# EasyEDA Pro project Balanced_Car.epro, board PCB4
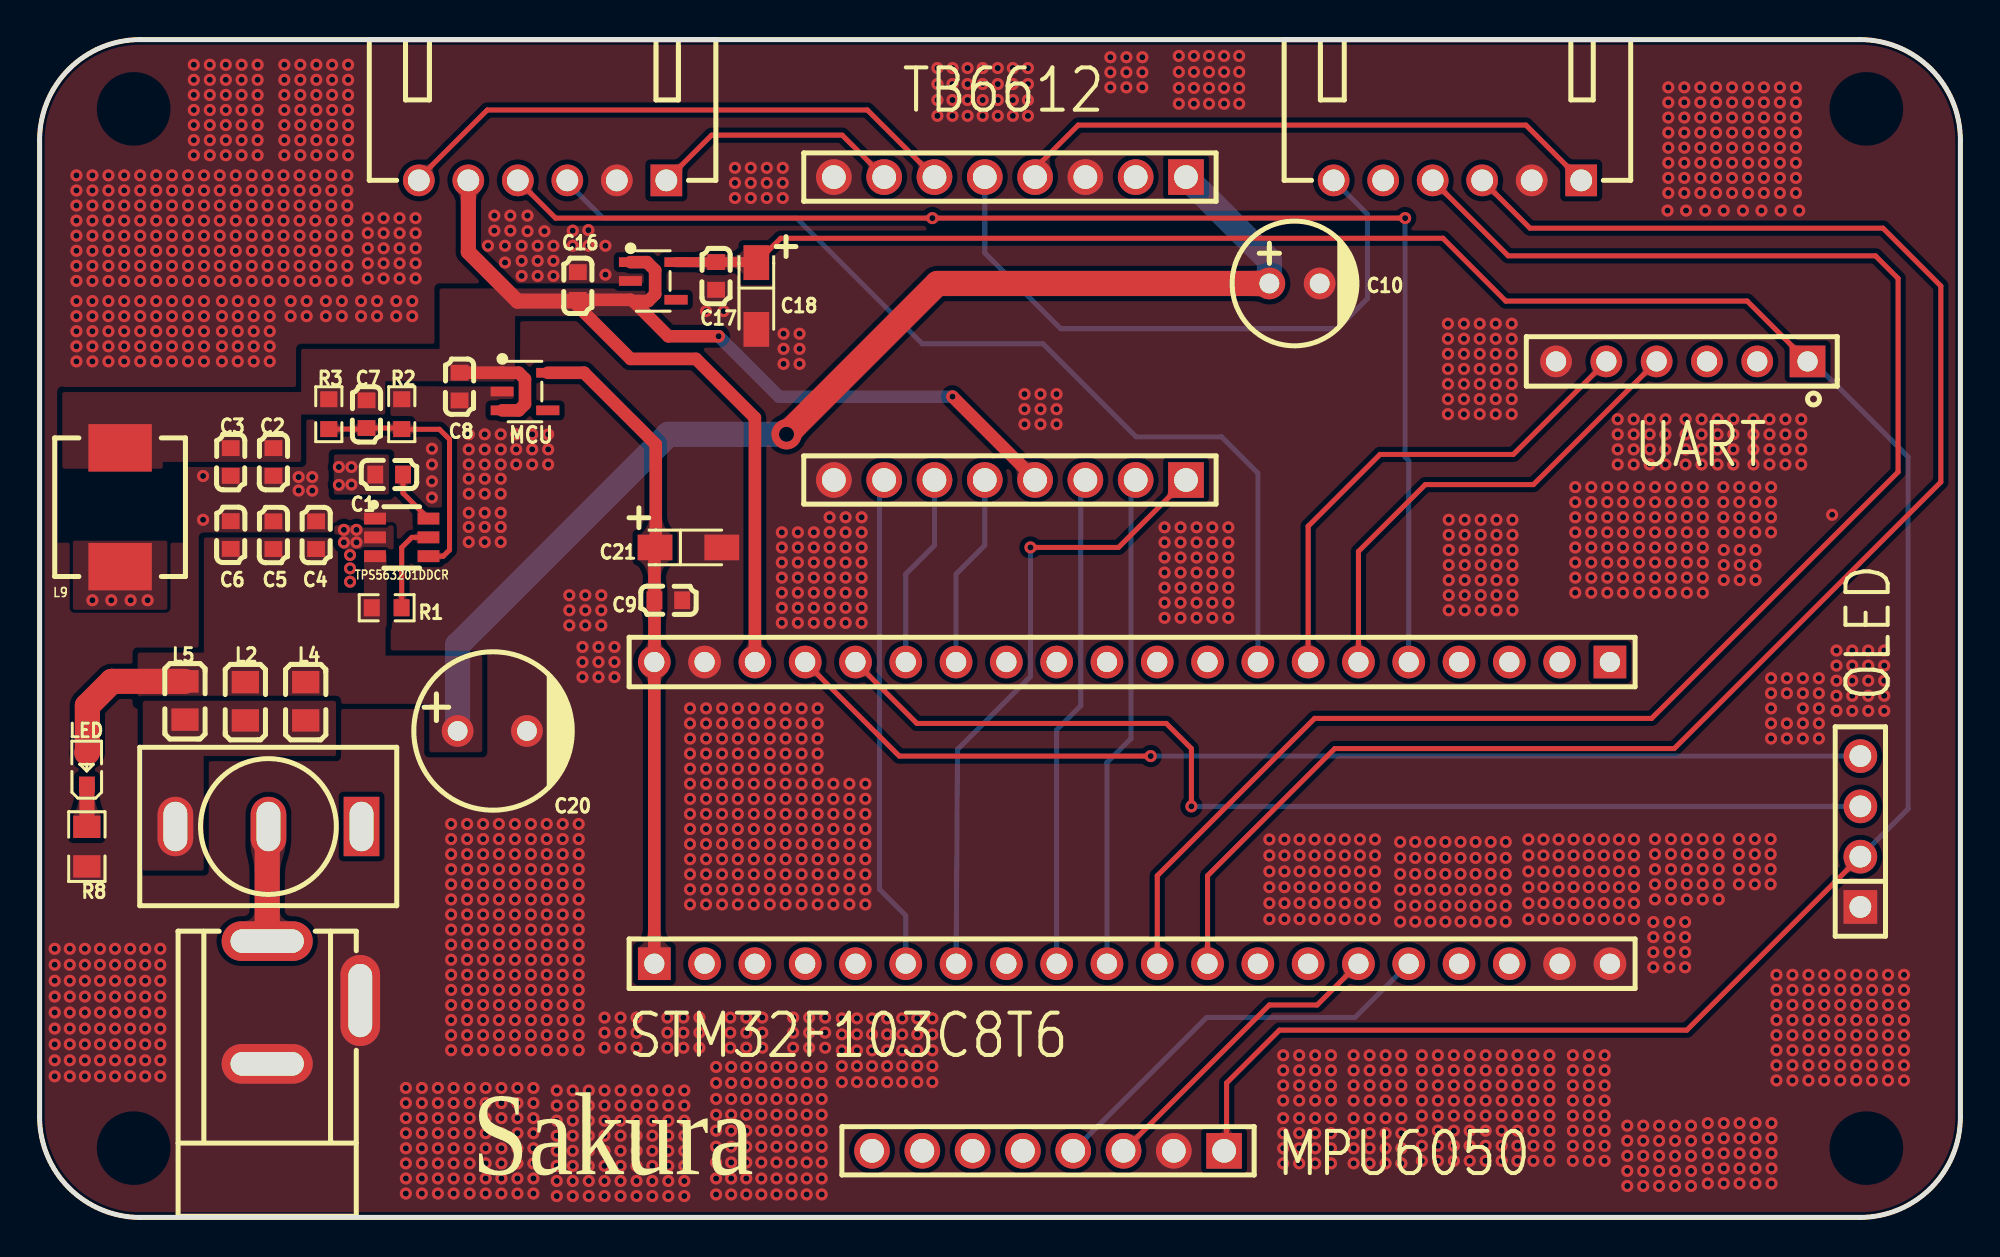
[diagram p1: board, top side]
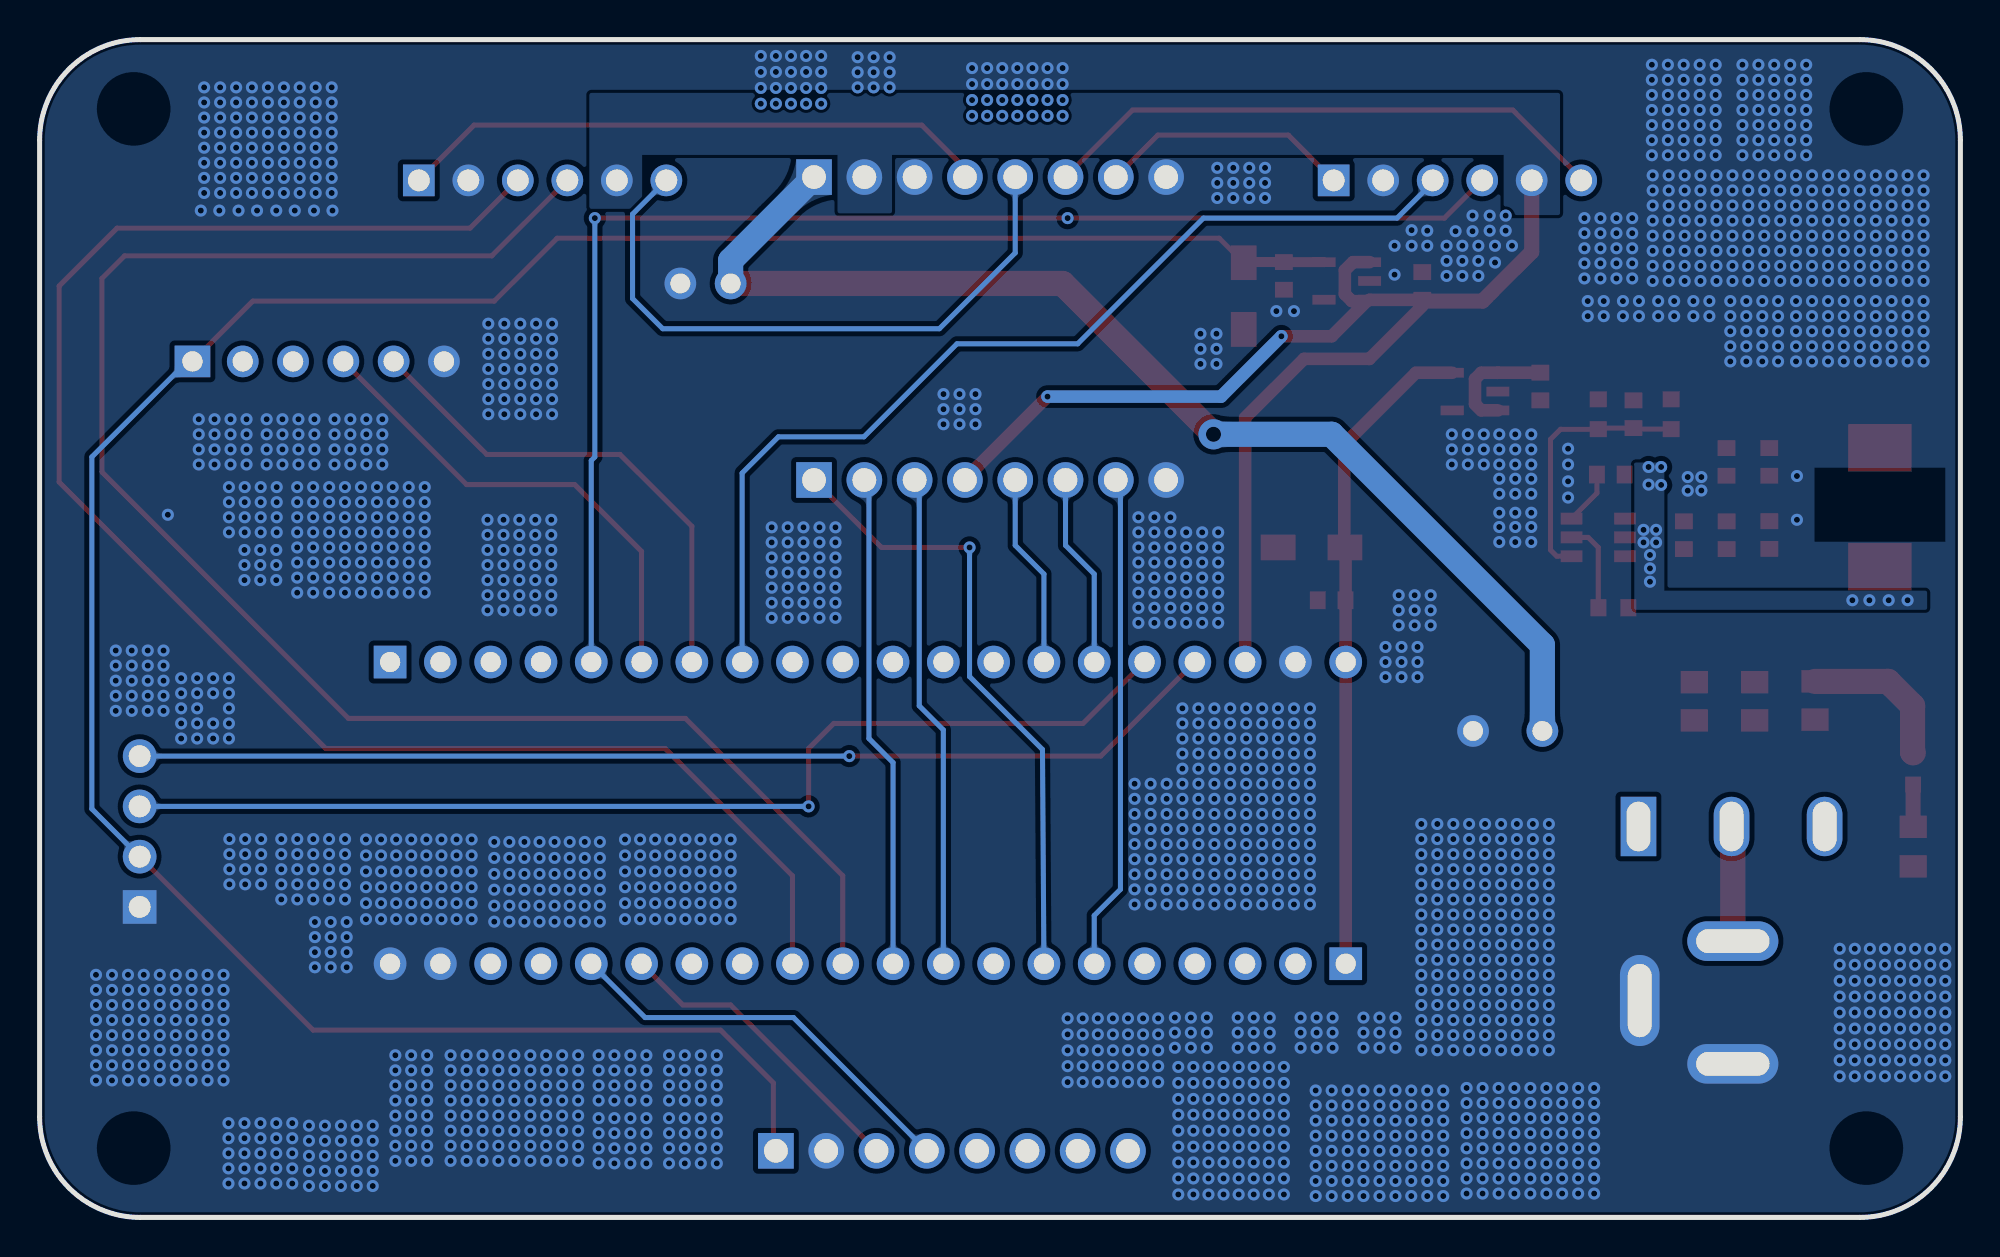
[diagram p2: board, bottom side, seen from below]

Outline 97 x 59.5 mm; copper layers: Top Layer, Bottom Layer. Coordinates in mm from the lower left corner of the outline.
Outline path: 0,54.42 arc(1.49,58.01) 5.08,59.5 91.92,59.5 arc(95.51,58.01) 97,54.42 97,5.08 arc(95.51,1.49) 91.92,0 5.08,0 arc(1.49,1.49) 0,5.08 0,54.42
Stack: Top Layer 0.035mm / Dielectric1 1.51mm FR4 er 4.5 / Bottom Layer 0.035mm

## Design rules (mm)
template: 自定义配置
spacing copperThickness1oz (default): track to track 0.102, other pairs 0.152 to 0.3
spacing copperThickness2oz: track to track 0.203, other pairs 0.152 to 0.3
track width copperThickness1oz (default): min 0.127, default 0.254, max 2.54
track width copperThickness2oz: min 0.203, default 0.254, max 2.54
differential pair differentialPair (default): width min 0.127, default 0.254, max 2.54; gap min 0.152, default 0.152
via viaSize (default): diameter min 0.5, default 0.61, max 10; hole min 0.3, default 0.305, max 6.3

## Placement (name value [footprint] x y rotation side)
C1  100nF  [C0603]  17.65 37.53 0 top
C2  22nF  [C0603]  11.81 38.16 90 top
C3  22nF  [C0603]  9.65 38.16 90 top
C4  10nF  [C0603]  13.96 34.46 270 top
C5  10nF  [C0603]  11.81 34.46 270 top
C6  10nF  [C0603]  9.65 34.47 270 top
C7  100nF  [C0603]  16.51 40.58 90 top
C8  1uF  [C0603]  21.21 41.97 90 top
C9  100nF  [C0603]  31.75 31.18 180 top
C10  220uF  [CAP-TH_BD6.3-P2.50-D1.0-FD]  63.37 47.18 0 top
C16  1uF  [C0603]  27.18 47.05 270 top
C17  100nF  [C0603]  34.16 47.56 90 top
C18  10uF  [CAP-SMD_L3.2-W1.6-RD-C7171]  36.19 46.54 270 top
C20  470uF  [CAP-TH_BD8.0-P3.50-D0.6-FD]  22.86 24.57 0 top
C21  10uF  [CAP-SMD_L3.2-W1.6-RD-C7171]  32.77 33.84 0 top
DC  DC005  [DC-IN-TH_DC005]  13.84 10.86 90 top
H7  -  [HDR-TH_8P-P2.54-V-F-1]  50.93 3.36 180 top
H8  PM254V-11-06-H85  [HDR-TH_6P-P2.54-V-F]  82.93 43.24 180 top
L2  10uH  [L0805]  10.39 26.07 90 top
L4  10uH  [L0805]  13.44 26.07 90 top
L5  10uH  [L0805]  7.34 26.11 90 top
L9  3.3uH  [IND-SMD_L7.0-W6.6]  4.06 35.88 270 top
LED  NCD0603G1  [LED0603-RD]  2.39 22.67 90 top
R1  10K  [R0603]  17.53 30.8 180 top
R2  10K  [R0603]  18.29 40.58 270 top
R3  54.9K  [R0603]  14.61 40.58 90 top
R8  10kΩ  [R0805]  2.39 18.73 270 top
U1  TPS563201DDCR  [SOT-23-6_L2.9-W1.6-P0.95-LS2.8-BR]  18.29 34.35 180 top
U2  -  [HDR-TH_8P-P2.54-V-F-1]  49 37.25 180 top
U3  TPRT9013-33GB  [SOT-23-5_L3.0-W1.7-P0.95-LS2.8-BL]  24.51 41.72 270 top
U5  -  [HDR-TH_8P-P2.54-V-F-1]  49 52.55 180 top
U6  TPRT9013-33GB  [SOT-23-5_L3.0-W1.7-P0.95-LS2.8-BL]  30.99 47.31 270 top
U7  PM2.54-1*4  [HDR-TH_4P-P2.54-V-F]  91.95 19.49 90 top
U11  KH-2.54FH-1X20P-H8.5  [HDR-TH_20P-P2.54-V-F-2]  55.17 12.82 0 top
U12  KH-2.54FH-1X20P-H8.5  [HDR-TH_20P-P2.54-V-F-2]  55.17 28.06 180 top
U13  X8821WR-06S-N0SN  [CONN-TH_6P-P2.50_X8821WR-06S-N2SN]  71.6 52.39 180 top
U14  X8821WR-06S-N0SN  [CONN-TH_6P-P2.50_X8821WR-06S-N2SN]  25.4 52.39 180 top
U16  MT-0-102-A101-M200-RS  [SW-TH_MT-0-103-A101-M200-RS]  11.56 19.75 180 top

## Footprints (pads in the part's own frame, mm; a bottom-side part is the same pattern mirrored in y, then rotated)
C0603
  rect 0.8x0.9 smd: 1(-0.7,0) 2(0.7,0)
CAP-SMD_L3.2-W1.6-RD-C7171
  rect 1.758x1.296 smd: 1(-1.687,0) 2(1.687,0)
CAP-TH_BD6.3-P2.50-D1.0-FD
  round 1.6 hole 1: 1(-1.27,0) 2(1.27,0)
CAP-TH_BD8.0-P3.50-D0.6-FD
  round 1.6 hole 1: 1(-1.75,0) 2(1.75,0)
CONN-TH_6P-P2.50_X8821WR-06S-N2SN
  rect 1.6x1.6 hole 1.1: 1(-6.25,0)
  round 1.6 hole 1.1: 2(-3.75,0) 3(-1.25,0) 4(1.25,0) 5(3.75,0) 6(6.25,0)
DC-IN-TH_DC005
  oval 2x4.6 hole 1.2x3.7: 1(3.1,2.35) 2(-3.1,2.35)
  oval 4.6x2 hole 3.7x1.2: 3(0.1,-2.35)
HDR-TH_4P-P2.54-V-F
  rect 1.7x1.7 hole 1.1: 1(-3.81,0)
  round 1.7 hole 1.1: 2(-1.27,0) 3(1.27,0) 4(3.81,0)
HDR-TH_6P-P2.54-V-F
  rect 1.8x1.6 hole 1.02: 1(-6.35,0)
  round 1.6 hole 1.02: 2(-3.81,0) 3(-1.27,0) 4(1.27,0) 5(3.81,0) 6(6.35,0)
HDR-TH_8P-P2.54-V-F-1
  rect 1.8x1.8 hole 1.2: 1(-8.89,0)
  round 1.8 hole 1.2: 2(-6.35,0) 3(-3.81,0) 4(-1.27,0) 5(1.27,0) 6(3.81,0) 7(6.35,0) 8(8.89,0)
HDR-TH_20P-P2.54-V-F-2
  rect 1.65x1.65 hole 1.02: 1(-24.13,0)
  round 1.65 hole 1.02: 2(-21.59,0) 3(-19.05,0) 4(-16.51,0) 5(-13.97,0) 6(-11.43,0) 7(-8.89,0) 8(-6.35,0) 9(-3.81,0) 10(-1.27,0) 11(1.27,0) 12(3.81,0) 13(6.35,0) 14(8.89,0) 15(11.43,0) 16(13.97,0) 17(16.51,0) 18(19.05,0) 19(21.59,0) 20(24.13,0)
IND-SMD_L7.0-W6.6
  rect 2.4x3.2 smd: 1(-3,0) 2(3,0)
L0805
  rect 1.133x1.377 smd: 1(-0.966,0) 2(0.966,0)
LED0603-RD
  rect 0.8x0.8 smd: 1(-0.799,-0.004) 2(0.799,0.004)
R0603
  rect 0.806x0.864 smd: 1(-0.753,0) 2(0.753,0)
R0805
  rect 1.133x1.377 smd: 1(-1,0) 2(1,0)
SOT-23-5_L3.0-W1.7-P0.95-LS2.8-BL
  rect 0.49x1.157 smd: 1(-0.95,-1.153) 2(0,-1.153) 3(0.95,-1.153)
  rect 0.49x1.175 smd: 4(0.95,1.153) 5(-0.95,1.153)
SOT-23-6_L2.9-W1.6-P0.95-LS2.8-BR
  rect 1.1x0.6 smd: 1(1.35,-0.95) 2(1.35,0) 3(1.35,0.95) 4(-1.35,0.95) 5(-1.35,0) 6(-1.35,-0.95)
SW-TH_MT-0-103-A101-M200-RS
  rect 1.8x3 hole 1.2x2.5: 1(-4.7,0)
  oval 1.8x3 hole 1.2x2.5: 2(0,0) 3(4.7,0)

## Nets
As in the schematic.

Pads without a net: H7 5 6 7 8; H8 2 3; U3 4; U6 4; U11 2 3 4 5 8 13 14 17 18; U12 1 2 3 4 9 10 11 12 13; U16 1

## Via types
v1: diameter 0.61, hole 0.305, Top Layer to Bottom Layer, 2055 vias
v2: diameter 1.524, hole 0.762, Top Layer to Bottom Layer, 1 via

## Routing (per net, layer and track width the routed paths; a pad name or vN(x,y) marks a point on that pad's centre or on a via; arc(x,y) is an arc through that point)
GND:
  vias: v1(0.76,13.57) v1(0.76,12.76) v1(0.76,11.95) v1(0.76,11.16) v1(0.76,10.35) v1(0.76,9.54) v1(0.76,8.74) v1(0.76,7.94) v1(0.76,7.13) v1(1.52,13.57) v1(1.52,12.76) v1(1.52,11.95) v1(1.52,11.16) v1(1.52,10.35) v1(1.52,9.54) v1(1.52,8.74) v1(1.52,7.94) v1(1.52,7.13) v1(1.86,52.64) v1(1.86,51.88) v1(1.86,51.12) v1(1.86,50.35) v1(1.86,49.59) v1(1.86,48.83) v1(1.86,48.07) v1(1.86,47.31) v1(1.86,46.29) v1(1.86,45.53) v1(1.86,44.77) v1(1.86,44) v1(1.86,43.24) v1(2.29,13.57) v1(2.29,12.76) v1(2.29,11.95) v1(2.29,11.16) v1(2.29,10.35) v1(2.29,9.54) v1(2.29,8.74) v1(2.29,7.94) v1(2.29,7.13) v1(2.67,52.64) v1(2.67,51.88) v1(2.67,51.12) v1(2.67,50.35) v1(2.67,49.59) v1(2.67,48.83) v1(2.67,48.07) v1(2.67,47.31) v1(2.67,46.29) v1(2.67,45.53) v1(2.67,44.77) v1(2.67,44) v1(2.67,43.24) v1(3.05,13.57) v1(3.05,12.76) v1(3.05,11.95) v1(3.05,11.16) v1(3.05,10.35) v1(3.05,9.54) v1(3.05,8.74) v1(3.05,7.94) v1(3.05,7.13) v1(3.47,52.64) v1(3.47,51.88) v1(3.47,51.12) v1(3.47,50.35) v1(3.47,49.59) v1(3.47,48.83) v1(3.47,48.07) v1(3.47,47.31) v1(3.47,46.29) v1(3.47,45.53) v1(3.47,44.77) v1(3.47,44) v1(3.47,43.24) v1(3.81,13.57) v1(3.81,12.76) v1(3.81,11.95) v1(3.81,11.16) v1(3.81,10.35) v1(3.81,9.54) v1(3.81,8.74) v1(3.81,7.94) v1(3.81,7.13) v1(4.27,52.64) v1(4.27,51.88) v1(4.27,51.12) v1(4.27,50.35) v1(4.27,49.59) v1(4.27,48.83) v1(4.27,48.07) v1(4.27,47.31) v1(4.27,46.29) v1(4.27,45.53) v1(4.27,44.77) v1(4.27,44) v1(4.27,43.24) v1(4.57,13.57) v1(4.57,12.76) v1(4.57,11.95) v1(4.57,11.16) v1(4.57,10.35) v1(4.57,9.54) v1(4.57,8.74) v1(4.57,7.94) v1(4.57,7.13) v1(5.08,52.64) v1(5.08,51.88) v1(5.08,51.12) v1(5.08,50.35) v1(5.08,49.59) v1(5.08,48.83) v1(5.08,48.07) v1(5.08,47.31) v1(5.08,46.29) v1(5.08,45.53) v1(5.08,44.77) v1(5.08,44) v1(5.08,43.24) v1(5.33,13.57) v1(5.33,12.76) v1(5.33,11.95) v1(5.33,11.16) v1(5.33,10.35) v1(5.33,9.54) v1(5.33,8.74) v1(5.33,7.94) v1(5.33,7.13) v1(5.89,52.64) v1(5.89,51.88) v1(5.89,51.12) v1(5.89,50.35) v1(5.89,49.59) v1(5.89,48.83) v1(5.89,48.07) v1(5.89,47.31) v1(5.89,46.29) v1(5.89,45.53) v1(5.89,44.77) v1(5.89,44) v1(5.89,43.24) v1(6.1,13.57) v1(6.1,12.76) v1(6.1,11.95) v1(6.1,11.16) v1(6.1,10.35) v1(6.1,9.54) v1(6.1,8.74) v1(6.1,7.94) v1(6.1,7.13) v1(6.69,52.64) v1(6.69,51.88) v1(6.69,51.12) v1(6.69,50.35) v1(6.69,49.59) v1(6.69,48.83) v1(6.69,48.07) v1(6.69,47.31) v1(6.69,46.29) v1(6.69,45.53) v1(6.69,44.77) v1(6.69,44) v1(6.69,43.24) v1(7.49,52.64) v1(7.49,51.88) v1(7.49,51.12) v1(7.49,50.35) v1(7.49,49.59) v1(7.49,48.83) v1(7.49,48.07) v1(7.49,47.31) v1(7.49,46.29) v1(7.49,45.53) v1(7.49,44.77) v1(7.49,44) v1(7.49,43.24) v1(7.79,58.23) v1(7.79,57.47) v1(7.79,56.7) v1(7.79,55.94) v1(7.79,55.18) v1(7.79,54.42) v1(7.79,53.66) v1(8.3,52.64) v1(8.3,51.88) v1(8.3,51.12) v1(8.3,50.35) v1(8.3,49.59) v1(8.3,48.83) v1(8.3,48.07) v1(8.3,47.31) v1(8.3,46.29) v1(8.3,45.53) v1(8.3,44.77) v1(8.3,44) v1(8.3,43.24) v1(8.25,37.45) v1(8.25,35.24) v1(8.6,58.23) v1(8.6,57.47) v1(8.6,56.7) v1(8.6,55.94) v1(8.6,55.18) v1(8.6,54.42) v1(8.6,53.66) v1(9.1,52.64) v1(9.1,51.88) v1(9.1,51.12) v1(9.1,50.35) v1(9.1,49.59) v1(9.1,48.83) v1(9.1,48.07) v1(9.1,47.31) v1(9.21,46.29) v1(9.21,45.53) v1(9.21,44.77) v1(9.21,44) v1(9.21,43.24) v1(9.4,58.23) v1(9.4,57.47) v1(9.4,56.7) v1(9.4,55.94) v1(9.4,55.18) v1(9.4,54.42) v1(9.4,53.66) v1(9.91,52.64) v1(9.91,51.88) v1(9.91,51.12) v1(9.91,50.35) v1(9.91,49.59) v1(9.91,48.83) v1(9.91,48.07) v1(9.91,47.31) v1(10,46.29) v1(10,45.53) v1(10,44.77) v1(10,44) v1(10,43.24) v1(10.2,58.23) v1(10.2,57.47) v1(10.2,56.7) v1(10.2,55.94) v1(10.2,55.18) v1(10.2,54.42) v1(10.2,53.66) v1(10.71,52.64) v1(10.71,51.88) v1(10.71,51.12) v1(10.71,50.35) v1(10.71,49.59) v1(10.71,48.83) v1(10.71,48.07) v1(10.71,47.31) v1(10.81,46.29) v1(10.81,45.53) v1(10.81,44.77) v1(10.81,44) v1(10.81,43.24) v1(11.01,58.23) v1(11.01,57.47) v1(11.01,56.7) v1(11.01,55.94) v1(11.01,55.18) v1(11.01,54.42) v1(11.01,53.66) v1(11.51,52.64) v1(11.51,51.88) v1(11.51,51.12) v1(11.51,50.35) v1(11.51,49.59) v1(11.51,48.83) v1(11.51,48.07) v1(11.51,47.31) v1(11.62,46.29) v1(11.62,45.53) v1(11.62,44.77) v1(11.62,44) v1(11.62,43.24) v1(12.32,52.64) v1(12.32,51.88) v1(12.32,51.12) v1(12.32,50.35) v1(12.32,49.59) v1(12.32,48.83) v1(12.32,48.07) v1(12.32,47.31) v1(12.36,58.23) v1(12.36,57.47) v1(12.36,56.7) v1(12.36,55.94) v1(12.36,55.18) v1(12.36,54.42) v1(12.36,53.66) v1(12.68,46.29) v1(12.68,45.53) v1(13.13,52.64) v1(13.13,51.88) v1(13.13,51.12) v1(13.13,50.35) v1(13.13,49.59) v1(13.13,48.83) v1(13.13,48.07) v1(13.13,47.31) v1(13.08,37.4) v1(13.08,36.72) v1(13.17,58.23) v1(13.17,57.47) v1(13.17,56.7) v1(13.17,55.94) v1(13.17,55.18) v1(13.17,54.42) v1(13.17,53.66) v1(13.48,46.29) v1(13.48,45.53) v1(13.77,37.4) v1(13.77,36.71) v1(13.92,52.64) v1(13.92,51.88) v1(13.92,51.12) v1(13.92,50.35) v1(13.92,49.59) v1(13.92,48.83) v1(13.92,48.07) v1(13.92,47.31) v1(13.97,58.23) v1(13.97,57.47) v1(13.97,56.7) v1(13.97,55.94) v1(13.97,55.18) v1(13.97,54.42) v1(13.97,53.66) v1(14.45,46.29) v1(14.45,45.53) v1(14.73,52.64) v1(14.73,51.88) v1(14.73,51.12) v1(14.73,50.35) v1(14.73,49.59) v1(14.73,48.83) v1(14.73,48.07) v1(14.73,47.31) v1(14.77,58.23) v1(14.77,57.47) v1(14.77,56.7) v1(14.77,55.94) v1(14.77,55.18) v1(14.77,54.42) v1(14.77,53.66) v1(15.26,46.29) v1(15.26,45.53) v1(15.54,52.64) v1(15.54,51.88) v1(15.54,51.12) v1(15.54,50.35) v1(15.54,49.59) v1(15.54,48.83) v1(15.54,48.07) v1(15.54,47.31) v1(15.58,58.23) v1(15.58,57.47) v1(15.58,56.7) v1(15.58,55.94) v1(15.58,55.18) v1(15.58,54.42) v1(15.58,53.66) v1(16.23,46.29) v1(16.23,45.53) v1(16.57,50.48) v1(16.57,49.72) v1(16.57,48.96) v1(16.57,48.2) v1(16.57,47.43) v1(17.04,46.29) v1(17.04,45.53) v1(17.37,50.48) v1(17.37,49.72) v1(17.37,48.96) v1(17.37,48.2) v1(17.37,47.43) v1(18.01,46.29) v1(18.01,45.53) v1(18.18,50.48) v1(18.18,49.72) v1(18.18,48.96) v1(18.18,48.2) v1(18.18,47.43) v1(18.5,6.54) v1(18.5,5.78) v1(18.5,5.02) v1(18.5,4.25) v1(18.5,3.49) v1(18.5,2.73) v1(18.5,1.97) v1(18.5,1.21) v1(18.82,46.29) v1(18.82,45.53) v1(18.99,50.48) v1(18.99,49.72) v1(18.99,48.96) v1(18.99,48.2) v1(18.99,47.43) v1(19.3,6.54) v1(19.3,5.78) v1(19.3,5.02) v1(19.3,4.25) v1(19.3,3.49) v1(19.3,2.73) v1(19.3,1.97) v1(19.3,1.21) v1(19.81,38.83) v1(19.81,38.04) v1(19.81,37.18) v1(19.81,36.37) v1(20.11,6.54) v1(20.11,5.78) v1(20.11,5.02) v1(20.11,4.25) v1(20.11,3.49) v1(20.11,2.73) v1(20.11,1.97) v1(20.11,1.21) v1(20.78,19.87) v1(20.78,19.11) v1(20.78,18.35) v1(20.78,17.59) v1(20.78,16.83) v1(20.78,16.06) v1(20.78,15.3) v1(20.78,14.54) v1(20.78,13.78) v1(20.78,13.02) v1(20.78,12.25) v1(20.78,11.49) v1(20.78,10.73) v1(20.78,9.97) v1(20.78,9.21) v1(20.78,8.44) v1(20.91,6.54) v1(20.91,5.78) v1(20.91,5.02) v1(20.91,4.25) v1(20.91,3.49) v1(20.91,2.73) v1(20.91,1.97) v1(20.91,1.21) v1(21.59,19.87) v1(21.59,19.11) v1(21.59,18.35) v1(21.59,17.59) v1(21.59,16.83) v1(21.59,16.06) v1(21.59,15.3) v1(21.59,14.54) v1(21.59,13.78) v1(21.59,13.02) v1(21.59,12.25) v1(21.59,11.49) v1(21.59,10.73) v1(21.59,9.97) v1(21.59,9.21) v1(21.59,8.44) v1(21.67,39.56) v1(21.67,38.8) v1(21.67,38.04) v1(21.67,37.32) v1(21.67,36.55) v1(21.67,35.6) v1(21.67,34.88) v1(21.67,34.11) v1(21.72,6.54) v1(21.72,5.78) v1(21.72,5.02) v1(21.72,4.25) v1(21.72,3.49) v1(21.72,2.73) v1(21.72,1.97) v1(21.72,1.21) v1(22.4,19.87) v1(22.4,19.11) v1(22.4,18.35) v1(22.4,17.59) v1(22.4,16.83) v1(22.4,16.06) v1(22.4,15.3) v1(22.4,14.54) v1(22.4,13.78) v1(22.4,13.02) v1(22.4,12.25) v1(22.4,11.49) v1(22.4,10.73) v1(22.4,9.97) v1(22.4,9.21) v1(22.4,8.44) v1(22.48,39.56) v1(22.48,38.8) v1(22.48,38.04) v1(22.48,37.32) v1(22.48,36.55) v1(22.48,35.6) v1(22.48,34.88) v1(22.48,34.11) v1(22.53,6.54) v1(22.53,5.78) v1(22.53,5.02) v1(22.53,4.25) v1(22.53,3.49) v1(22.53,2.73) v1(22.53,1.97) v1(22.53,1.21) v1(22.64,49.08) v1(22.96,50.61) v1(22.96,49.85) v1(23.19,19.87) v1(23.19,19.11) v1(23.19,18.35) v1(23.19,17.59) v1(23.19,16.83) v1(23.19,16.06) v1(23.19,15.3) v1(23.19,14.54) v1(23.19,13.78) v1(23.19,13.02) v1(23.19,12.25) v1(23.19,11.49) v1(23.19,10.73) v1(23.19,9.97) v1(23.19,9.21) v1(23.19,8.44) v1(23.29,39.56) v1(23.29,38.8) v1(23.29,38.04) v1(23.29,37.32) v1(23.29,36.55) v1(23.29,35.6) v1(23.29,34.88) v1(23.29,34.11) v1(23.32,6.54) v1(23.32,5.78) v1(23.32,5.02) v1(23.32,4.25) v1(23.32,3.49) v1(23.32,2.73) v1(23.32,1.97) v1(23.32,1.21) v1(23.5,49.08) v1(23.5,48.24) v1(23.77,50.61) v1(23.77,49.85) v1(24,19.87) v1(24,19.11) v1(24,18.35) v1(24,17.59) v1(24,16.83) v1(24,16.06) v1(24,15.3) v1(24,14.54) v1(24,13.78) v1(24,13.02) v1(24,12.25) v1(24,11.49) v1(24,10.73) v1(24,9.97) v1(24,9.21) v1(24,8.44) v1(24.07,39.56) v1(24.07,38.8) v1(24.07,38.04) v1(24.13,6.54) v1(24.13,5.78) v1(24.13,5.02) v1(24.13,4.25) v1(24.13,3.49) v1(24.13,2.73) v1(24.13,1.97) v1(24.13,1.21) v1(24.34,49.08) v1(24.34,48.32) v1(24.34,47.56) v1(24.64,50.61) v1(24.64,49.82) v1(24.81,19.87) v1(24.81,19.11) v1(24.81,18.35) v1(24.81,17.59) v1(24.81,16.83) v1(24.81,16.06) v1(24.81,15.3) v1(24.81,14.54) v1(24.81,13.78) v1(24.81,13.02) v1(24.81,12.25) v1(24.81,11.49) v1(24.81,10.73) v1(24.81,9.97) v1(24.81,9.21) v1(24.81,8.44) v1(24.88,39.56) v1(24.88,38.8) v1(24.88,38.04) v1(24.94,6.54) v1(24.94,5.78) v1(24.94,5.02) v1(24.94,4.25) v1(24.94,3.49) v1(24.94,2.73) v1(24.94,1.97) v1(24.94,1.21) v1(25.15,49.08) v1(25.15,48.32) v1(25.15,47.56) v1(25.5,49.82) v1(25.61,19.87) v1(25.61,19.11) v1(25.61,18.35) v1(25.61,17.59) v1(25.61,16.83) v1(25.61,16.06) v1(25.61,15.3) v1(25.61,14.54) v1(25.61,13.78) v1(25.61,13.02) v1(25.61,12.25) v1(25.61,11.49) v1(25.61,10.73) v1(25.61,9.97) v1(25.61,9.21) v1(25.61,8.44) v1(25.68,39.56) v1(25.68,38.8) v1(25.68,38.04) v1(25.95,49.08) v1(25.95,48.32) v1(25.95,47.56) v1(26.12,6.41) v1(26.12,5.65) v1(26.12,4.89) v1(26.12,4.13) v1(26.12,3.36) v1(26.12,2.6) v1(26.12,1.84) v1(26.12,1.08) v1(26.42,19.87) v1(26.42,19.11) v1(26.42,18.35) v1(26.42,17.59) v1(26.42,16.83) v1(26.42,16.06) v1(26.42,15.3) v1(26.42,14.54) v1(26.42,13.78) v1(26.42,13.02) v1(26.42,12.25) v1(26.42,11.49) v1(26.42,10.73) v1(26.42,9.97) v1(26.42,9.21) v1(26.42,8.44) v1(26.75,31.43) v1(26.75,30.67) v1(26.75,29.91) v1(26.92,49.85) v1(26.92,49.08) v1(26.92,6.41) v1(26.92,5.65) v1(26.92,4.89) v1(26.92,4.13) v1(26.92,3.36) v1(26.92,2.6) v1(26.92,1.84) v1(26.92,1.08) v1(27.22,19.87) v1(27.22,19.11) v1(27.22,18.35) v1(27.22,17.59) v1(27.22,16.83) v1(27.22,16.06) v1(27.22,15.3) v1(27.22,14.54) v1(27.22,13.78) v1(27.22,13.02) v1(27.22,12.25) v1(27.22,11.49) v1(27.22,10.73) v1(27.22,9.97) v1(27.22,9.21) v1(27.22,8.44) v1(27.42,28.82) v1(27.42,28.06) v1(27.42,27.29) v1(27.56,31.43) v1(27.56,30.67) v1(27.56,29.91) v1(27.71,49.87) v1(27.71,49.08) v1(27.73,6.41) v1(27.73,5.65) v1(27.73,4.89) v1(27.73,4.13) v1(27.73,3.36) v1(27.73,2.6) v1(27.73,1.84) v1(27.73,1.08) v1(28.22,28.82) v1(28.22,28.06) v1(28.22,27.29) v1(28.37,31.43) v1(28.37,30.67) v1(28.37,29.91) v1(28.53,10.1) v1(28.53,9.33) v1(28.53,8.57) v1(28.53,6.41) v1(28.53,5.65) v1(28.53,4.89) v1(28.53,4.13) v1(28.53,3.36) v1(28.53,2.6) v1(28.53,1.84) v1(28.53,1.08) v1(28.57,49.08) v1(28.57,47.62) v1(29.03,28.82) v1(29.03,28.06) v1(29.03,27.29) v1(29.34,10.1) v1(29.34,9.33) v1(29.34,8.57) v1(29.34,6.41) v1(29.34,5.65) v1(29.34,4.89) v1(29.34,4.13) v1(29.34,3.36) v1(29.34,2.6) v1(29.34,1.84) v1(29.34,1.08) v1(30.15,10.1) v1(30.15,9.33) v1(30.15,8.57) v1(30.15,6.41) v1(30.15,5.65) v1(30.15,4.89) v1(30.15,4.13) v1(30.15,3.36) v1(30.15,2.6) v1(30.15,1.84) v1(30.15,1.08) v1(30.94,6.41) v1(30.94,5.65) v1(30.94,4.89) v1(30.94,4.13) v1(30.94,3.36) v1(30.94,2.6) v1(30.94,1.84) v1(30.94,1.08) v1(31.7,10.1) v1(31.7,9.33) v1(31.7,8.57) v1(31.75,6.41) v1(31.75,5.65) v1(31.75,4.89) v1(31.75,4.13) v1(31.75,3.36) v1(31.75,2.6) v1(31.75,1.84) v1(31.75,1.08) v1(32.51,10.1) v1(32.51,9.33) v1(32.51,8.57) v1(32.56,6.41) v1(32.56,5.65) v1(32.56,4.89) v1(32.56,4.13) v1(32.56,3.36) v1(32.56,2.6) v1(32.56,1.84) v1(32.56,1.08) v1(32.85,25.72) v1(32.85,24.95) v1(32.85,24.19) v1(32.85,23.43) v1(32.85,22.67) v1(32.85,21.91) v1(32.85,21.14) v1(32.85,20.38) v1(32.85,19.62) v1(32.85,18.86) v1(32.85,18.1) v1(32.85,17.33) v1(32.85,16.57) v1(32.85,15.81) v1(33.32,10.1) v1(33.32,9.33) v1(33.32,8.57) v1(33.66,45.78) v1(33.66,25.72) v1(33.66,24.95) v1(33.66,24.19) v1(33.66,23.43) v1(33.66,22.67) v1(33.66,21.91) v1(33.66,21.14) v1(33.66,20.38) v1(33.66,19.62) v1(33.66,18.86) v1(33.66,18.1) v1(33.66,17.33) v1(33.66,16.57) v1(33.66,15.81) v1(34.16,7.6) v1(34.16,6.79) v1(34.16,5.99) v1(34.16,5.19) v1(34.16,4.38) v1(34.16,3.57) v1(34.16,2.78) v1(34.16,1.97) v1(34.16,1.16) v1(34.54,45.78) v1(34.46,25.72) v1(34.46,24.95) v1(34.46,24.19) v1(34.46,23.43) v1(34.46,22.67) v1(34.46,21.91) v1(34.46,21.14) v1(34.46,20.38) v1(34.46,19.62) v1(34.46,18.86) v1(34.46,18.1) v1(34.46,17.33) v1(34.46,16.57) v1(34.46,15.81) v1(34.88,10.1) v1(34.88,9.33) v1(34.88,8.57) v1(34.93,7.6) v1(34.93,6.79) v1(34.93,5.99) v1(34.93,5.19) v1(34.93,4.38) v1(34.93,3.57) v1(34.93,2.78) v1(34.93,1.97) v1(34.93,1.16) v1(35.12,53.02) v1(35.12,52.26) v1(35.12,51.5) v1(35.26,25.72) v1(35.26,24.95) v1(35.26,24.19) v1(35.26,23.43) v1(35.26,22.67) v1(35.26,21.91) v1(35.26,21.14) v1(35.26,20.38) v1(35.26,19.62) v1(35.26,18.86) v1(35.26,18.1) v1(35.26,17.33) v1(35.26,16.57) v1(35.26,15.81) v1(35.69,10.1) v1(35.69,9.33) v1(35.69,8.57) v1(35.69,7.6) v1(35.69,6.79) v1(35.69,5.99) v1(35.69,5.19) v1(35.69,4.38) v1(35.69,3.57) v1(35.69,2.78) v1(35.69,1.97) v1(35.69,1.16) v1(35.91,53.02) v1(35.91,52.26) v1(35.91,51.5) v1(36.07,25.72) v1(36.07,24.95) v1(36.07,24.19) v1(36.07,23.43) v1(36.07,22.67) v1(36.07,21.91) v1(36.07,21.14) v1(36.07,20.38) v1(36.07,19.62) v1(36.07,18.86) v1(36.07,18.1) v1(36.07,17.33) v1(36.07,16.57) v1(36.07,15.81) v1(36.45,7.6) v1(36.45,6.79) v1(36.45,5.99) v1(36.45,5.19) v1(36.45,4.38) v1(36.45,3.57) v1(36.45,2.78) v1(36.45,1.97) v1(36.45,1.16) v1(36.5,10.1) v1(36.5,9.33) v1(36.5,8.57) v1(36.72,53.02) v1(36.72,52.26) v1(36.72,51.5) v1(36.88,25.72) v1(36.88,24.95) v1(36.88,24.19) v1(36.88,23.43) v1(36.88,22.67) v1(36.88,21.91) v1(36.88,21.14) v1(36.88,20.38) v1(36.88,19.62) v1(36.88,18.86) v1(36.88,18.1) v1(36.88,17.33) v1(36.88,16.57) v1(36.88,15.81) v1(37.21,7.6) v1(37.21,6.79) v1(37.21,5.99) v1(37.21,5.19) v1(37.21,4.38) v1(37.21,3.57) v1(37.21,2.78) v1(37.21,1.97) v1(37.21,1.16) v1(37.53,53.02) v1(37.53,52.26) v1(37.53,51.5) v1(37.48,34.61) v1(37.48,33.84) v1(37.48,33.08) v1(37.48,32.32) v1(37.48,31.56) v1(37.48,30.8) v1(37.48,30.03) v1(37.57,44.64) v1(37.57,43.88) v1(37.57,43.12) v1(37.67,25.72) v1(37.67,24.95) v1(37.67,24.19) v1(37.67,23.43) v1(37.67,22.67) v1(37.67,21.91) v1(37.67,21.14) v1(37.67,20.38) v1(37.67,19.62) v1(37.67,18.86) v1(37.67,18.1) v1(37.67,17.33) v1(37.67,16.57) v1(37.67,15.81) v1(37.97,7.6) v1(37.97,6.79) v1(37.97,5.99) v1(37.97,5.19) v1(37.97,4.38) v1(37.97,3.57) v1(37.97,2.78) v1(37.97,1.97) v1(37.97,1.16) v1(38.05,10.1) v1(38.05,9.33) v1(38.05,8.57) v1(38.29,34.61) v1(38.29,33.84) v1(38.29,33.08) v1(38.29,32.32) v1(38.29,31.56) v1(38.29,30.8) v1(38.29,30.03) v1(38.38,44.64) v1(38.38,43.88) v1(38.38,43.12) v1(38.48,25.72) v1(38.48,24.95) v1(38.48,24.19) v1(38.48,23.43) v1(38.48,22.67) v1(38.48,21.91) v1(38.48,21.14) v1(38.48,20.38) v1(38.48,19.62) v1(38.48,18.86) v1(38.48,18.1) v1(38.48,17.33) v1(38.48,16.57) v1(38.48,15.81) v1(38.74,7.6) v1(38.74,6.79) v1(38.74,5.99) v1(38.74,5.19) v1(38.74,4.38) v1(38.74,3.57) v1(38.74,2.78) v1(38.74,1.97) v1(38.74,1.16) v1(38.86,10.1) v1(38.86,9.33) v1(38.86,8.57) v1(39.1,34.61) v1(39.1,33.84) v1(39.1,33.08) v1(39.1,32.32) v1(39.1,31.56) v1(39.1,30.8) v1(39.1,30.03) v1(39.29,25.72) v1(39.29,24.95) v1(39.29,24.19) v1(39.29,23.43) v1(39.29,22.67) v1(39.29,21.91) v1(39.29,21.14) v1(39.29,20.38) v1(39.29,19.62) v1(39.29,18.86) v1(39.29,18.1) v1(39.29,17.33) v1(39.29,16.57) v1(39.29,15.81) v1(39.5,7.6) v1(39.5,6.79) v1(39.5,5.99) v1(39.5,5.19) v1(39.5,4.38) v1(39.5,3.57) v1(39.5,2.78) v1(39.5,1.97) v1(39.5,1.16) v1(39.67,10.1) v1(39.67,9.33) v1(39.67,8.57) v1(39.9,35.37) v1(39.9,34.61) v1(39.9,33.84) v1(39.9,33.08) v1(39.9,32.32) v1(39.9,31.56) v1(39.9,30.8) v1(39.9,30.03) v1(40.09,21.91) v1(40.09,21.14) v1(40.09,20.38) v1(40.09,19.62) v1(40.09,18.86) v1(40.09,18.1) v1(40.09,17.33) v1(40.09,16.57) v1(40.09,15.81) v1(40.51,10.05) v1(40.51,9.25) v1(40.51,8.44) v1(40.51,7.64) v1(40.51,6.83) v1(40.7,35.37) v1(40.7,34.61) v1(40.7,33.84) v1(40.7,33.08) v1(40.7,32.32) v1(40.7,31.56) v1(40.7,30.8) v1(40.7,30.03) v1(40.89,21.91) v1(40.89,21.14) v1(40.89,20.38) v1(40.89,19.62) v1(40.89,18.86) v1(40.89,18.1) v1(40.89,17.33) v1(40.89,16.57) v1(40.89,15.81) v1(41.28,10.05) v1(41.28,9.25) v1(41.28,8.44) v1(41.28,7.64) v1(41.28,6.83) v1(41.51,35.37) v1(41.51,34.61) v1(41.51,33.84) v1(41.51,33.08) v1(41.51,32.32) v1(41.51,31.56) v1(41.51,30.8) v1(41.51,30.03) v1(41.7,21.91) v1(41.7,21.14) v1(41.7,20.38) v1(41.7,19.62) v1(41.7,18.86) v1(41.7,18.1) v1(41.7,17.33) v1(41.7,16.57) v1(41.7,15.81) v1(42.04,10.05) v1(42.04,9.25) v1(42.04,8.44) v1(42.04,7.64) v1(42.04,6.83) v1(42.8,10.05) v1(42.8,9.25) v1(42.8,8.44) v1(42.8,7.64) v1(42.8,6.83) v1(43.56,10.05) v1(43.56,9.25) v1(43.56,8.44) v1(43.56,7.64) v1(43.56,6.83) v1(44.32,10.05) v1(44.32,9.25) v1(44.32,8.44) v1(44.32,7.64) v1(44.32,6.83) v1(45.09,10.05) v1(45.09,9.25) v1(45.09,8.44) v1(45.09,7.64) v1(45.09,6.83) v1(45.34,58.06) v1(45.34,57.25) v1(45.34,56.45) v1(45.34,55.65) v1(46.1,58.06) v1(46.1,57.25) v1(46.1,56.45) v1(46.1,55.65) v1(46.86,58.06) v1(46.86,57.25) v1(46.86,56.45) v1(46.86,55.65) v1(47.62,58.06) v1(47.62,57.25) v1(47.62,56.45) v1(47.62,55.65) v1(48.39,58.06) v1(48.39,57.25) v1(48.39,56.45) v1(48.39,55.65) v1(49.15,58.06) v1(49.15,57.25) v1(49.15,56.45) v1(49.15,55.65) v1(49.74,41.59) v1(49.74,40.83) v1(49.74,40.07) v1(49.91,58.06) v1(49.91,57.25) v1(49.91,56.45) v1(49.91,55.65) v1(50.55,41.59) v1(50.55,40.83) v1(50.55,40.07) v1(51.35,41.59) v1(51.35,40.83) v1(51.35,40.07) v1(54.07,58.61) v1(54.07,57.85) v1(54.07,57.09) v1(54.88,58.61) v1(54.88,57.85) v1(54.88,57.09) v1(55.69,58.61) v1(55.69,57.85) v1(55.69,57.09) v1(56.81,34.86) v1(56.81,34.1) v1(56.81,33.34) v1(56.81,32.57) v1(56.81,31.81) v1(56.81,31.05) v1(56.81,30.29) v1(57.53,58.67) v1(57.53,57.86) v1(57.53,57.06) v1(57.53,56.26) v1(57.62,34.86) v1(57.62,34.1) v1(57.62,33.34) v1(57.62,32.57) v1(57.62,31.81) v1(57.62,31.05) v1(57.62,30.29) v1(58.29,58.67) v1(58.29,57.86) v1(58.29,57.06) v1(58.29,56.26) v1(58.43,34.86) v1(58.43,34.1) v1(58.43,33.34) v1(58.43,32.57) v1(58.43,31.81) v1(58.43,31.05) v1(58.43,30.29) v1(59.06,58.67) v1(59.06,57.86) v1(59.06,57.06) v1(59.06,56.26) v1(59.22,34.86) v1(59.22,34.1) v1(59.22,33.34) v1(59.22,32.57) v1(59.22,31.81) v1(59.22,31.05) v1(59.22,30.29) v1(59.82,58.67) v1(59.82,57.86) v1(59.82,57.06) v1(59.82,56.26) v1(60.03,34.86) v1(60.03,34.1) v1(60.03,33.34) v1(60.03,32.57) v1(60.03,31.81) v1(60.03,31.05) v1(60.03,30.29) v1(60.58,58.67) v1(60.58,57.86) v1(60.58,57.06) v1(60.58,56.26) v1(62.1,19.09) v1(62.1,18.29) v1(62.1,17.48) v1(62.1,16.68) v1(62.1,15.87) v1(62.1,15.07) v1(62.8,8.19) v1(62.8,7.43) v1(62.8,6.67) v1(62.8,5.9) v1(62.8,5.02) v1(62.8,4.25) v1(62.8,3.49) v1(62.8,2.73) v1(62.87,19.09) v1(62.87,18.29) v1(62.87,17.48) v1(62.87,16.68) v1(62.87,15.87) v1(62.87,15.07) v1(63.63,19.09) v1(63.63,18.29) v1(63.63,17.48) v1(63.63,16.68) v1(63.63,15.87) v1(63.63,15.07) v1(63.61,8.19) v1(63.61,7.43) v1(63.61,6.67) v1(63.61,5.9) v1(63.61,5.02) v1(63.61,4.25) v1(63.61,3.49) v1(63.61,2.73) v1(64.39,19.09) v1(64.39,18.29) v1(64.39,17.48) v1(64.39,16.68) v1(64.39,15.87) v1(64.39,15.07) v1(64.42,8.19) v1(64.42,7.43) v1(64.42,6.67) v1(64.42,5.9) v1(64.42,5.02) v1(64.42,4.25) v1(64.42,3.49) v1(64.42,2.73) v1(65.15,19.09) v1(65.15,18.29) v1(65.15,17.48) v1(65.15,16.68) v1(65.15,15.87) v1(65.15,15.07) v1(65.21,8.19) v1(65.21,7.43) v1(65.21,6.67) v1(65.21,5.9) v1(65.21,5.02) v1(65.21,4.25) v1(65.21,3.49) v1(65.21,2.73) v1(65.91,19.09) v1(65.91,18.29) v1(65.91,17.48) v1(65.91,16.68) v1(65.91,15.87) v1(65.91,15.07) v1(66.36,8.19) v1(66.36,7.43) v1(66.36,6.67) v1(66.36,5.9) v1(66.36,5.02) v1(66.36,4.25) v1(66.36,3.49) v1(66.36,2.73) v1(66.68,19.09) v1(66.68,18.29) v1(66.68,17.48) v1(66.68,16.68) v1(66.68,15.87) v1(66.68,15.07) v1(67.17,8.19) v1(67.17,7.43) v1(67.17,6.67) v1(67.17,5.9) v1(67.17,5.02) v1(67.17,4.25) v1(67.17,3.49) v1(67.17,2.73) v1(67.44,19.09) v1(67.44,18.29) v1(67.44,17.48) v1(67.44,16.68) v1(67.44,15.87) v1(67.44,15.07) v1(67.97,8.19) v1(67.97,7.43) v1(67.97,6.67) v1(67.97,5.9) v1(67.97,5.02) v1(67.97,4.25) v1(67.97,3.49) v1(67.97,2.73) v1(68.71,18.97) v1(68.71,18.16) v1(68.71,17.35) v1(68.71,16.55) v1(68.71,15.75) v1(68.71,14.94) v1(68.77,8.19) v1(68.77,7.43) v1(68.77,6.67) v1(68.77,5.9) v1(68.77,5.02) v1(68.77,4.25) v1(68.77,3.49) v1(68.77,2.73) v1(69.47,18.97) v1(69.47,18.16) v1(69.47,17.35) v1(69.47,16.55) v1(69.47,15.75) v1(69.47,14.94) v1(69.8,8.19) v1(69.8,7.43) v1(69.8,6.67) v1(69.8,5.9) v1(69.8,5.14) v1(69.8,4.38) v1(69.8,3.62) v1(69.8,2.86) v1(70.23,18.97) v1(70.23,18.16) v1(70.23,17.35) v1(70.23,16.55) v1(70.23,15.75) v1(70.23,14.94) v1(70.61,8.19) v1(70.61,7.43) v1(70.61,6.67) v1(70.61,5.9) v1(70.61,5.14) v1(70.61,4.38) v1(70.61,3.62) v1(70.61,2.86) v1(70.99,18.97) v1(70.99,18.16) v1(70.99,17.35) v1(70.99,16.55) v1(70.99,15.75) v1(70.99,14.94) v1(71.12,45.15) v1(71.12,44.39) v1(71.12,43.62) v1(71.12,42.86) v1(71.12,42.1) v1(71.12,41.34) v1(71.12,40.58) v1(71.16,35.24) v1(71.16,34.48) v1(71.16,33.72) v1(71.16,32.96) v1(71.16,32.19) v1(71.16,31.43) v1(71.16,30.67) v1(71.42,8.19) v1(71.42,7.43) v1(71.42,6.67) v1(71.42,5.9) v1(71.42,5.14) v1(71.42,4.38) v1(71.42,3.62) v1(71.42,2.86) v1(71.75,18.97) v1(71.75,18.16) v1(71.75,17.35) v1(71.75,16.55) v1(71.75,15.75) v1(71.75,14.94) v1(71.93,45.15) v1(71.93,44.39) v1(71.93,43.62) v1(71.93,42.86) v1(71.93,42.1) v1(71.93,41.34) v1(71.93,40.58) v1(71.97,35.24) v1(71.97,34.48) v1(71.97,33.72) v1(71.97,32.96) v1(71.97,32.19) v1(71.97,31.43) v1(71.97,30.67) v1(72.22,8.19) v1(72.22,7.43) v1(72.22,6.67) v1(72.22,5.9) v1(72.22,5.14) v1(72.22,4.38) v1(72.22,3.62) v1(72.22,2.86) v1(72.52,18.97) v1(72.52,18.16) v1(72.52,17.35) v1(72.52,16.55) v1(72.52,15.75) v1(72.52,14.94) v1(72.72,45.15) v1(72.72,44.39) v1(72.72,43.62) v1(72.72,42.86) v1(72.72,42.1) v1(72.72,41.34) v1(72.72,40.58) v1(72.78,35.24) v1(72.78,34.48) v1(72.78,33.72) v1(72.78,32.96) v1(72.78,32.19) v1(72.78,31.43) v1(72.78,30.67) v1(73.03,8.19) v1(73.03,7.43) v1(73.03,6.67) v1(73.03,5.9) v1(73.03,5.14) v1(73.03,4.38) v1(73.03,3.62) v1(73.03,2.86) v1(73.28,18.97) v1(73.28,18.16) v1(73.28,17.35) v1(73.28,16.55) v1(73.28,15.75) v1(73.28,14.94) v1(73.53,45.15) v1(73.53,44.39) v1(73.53,43.62) v1(73.53,42.86) v1(73.53,42.1) v1(73.53,41.34) v1(73.53,40.58) v1(73.57,35.24) v1(73.57,34.48) v1(73.57,33.72) v1(73.57,32.96) v1(73.57,32.19) v1(73.57,31.43) v1(73.57,30.67) v1(73.83,8.19) v1(73.83,7.43) v1(73.83,6.67) v1(73.83,5.9) v1(73.83,5.14) v1(73.83,4.38) v1(73.83,3.62) v1(73.83,2.86) v1(74.04,18.97) v1(74.04,18.16) v1(74.04,17.35) v1(74.04,16.55) v1(74.04,15.75) v1(74.04,14.94) v1(74.34,45.15) v1(74.34,44.39) v1(74.34,43.62) v1(74.34,42.86) v1(74.34,42.1) v1(74.34,41.34) v1(74.34,40.58) v1(74.38,35.24) v1(74.38,34.48) v1(74.38,33.72) v1(74.38,32.96) v1(74.38,32.19) v1(74.38,31.43) v1(74.38,30.67) v1(74.63,8.19) v1(74.63,7.43) v1(74.63,6.67) v1(74.63,5.9) v1(74.63,5.14) v1(74.63,4.38) v1(74.63,3.62) v1(74.63,2.86) v1(75.18,19.09) v1(75.18,18.29) v1(75.18,17.48) v1(75.18,16.68) v1(75.18,15.87) v1(75.18,15.07) v1(75.44,8.19) v1(75.44,7.43) v1(75.44,6.67) v1(75.44,5.9) v1(75.44,5.14) v1(75.44,4.38) v1(75.44,3.62) v1(75.44,2.86) v1(75.95,19.09) v1(75.95,18.29) v1(75.95,17.48) v1(75.95,16.68) v1(75.95,15.87) v1(75.95,15.07) v1(76.25,8.19) v1(76.25,7.43) v1(76.25,6.67) v1(76.25,5.9) v1(76.25,5.14) v1(76.25,4.38) v1(76.25,3.62) v1(76.25,2.86) v1(76.71,19.09) v1(76.71,18.29) v1(76.71,17.48) v1(76.71,16.68) v1(76.71,15.87) v1(76.71,15.07) v1(77.43,8.19) v1(77.43,7.43) v1(77.43,6.67) v1(77.43,5.9) v1(77.43,5.14) v1(77.43,4.38) v1(77.43,3.62) v1(77.43,2.86) v1(77.47,19.09) v1(77.47,18.29) v1(77.47,17.48) v1(77.47,16.68) v1(77.47,15.87) v1(77.47,15.07) v1(77.55,36.89) v1(77.55,36.13) v1(77.55,35.37) v1(77.55,34.61) v1(77.55,33.84) v1(77.55,33.08) v1(77.55,32.32) v1(77.55,31.56) v1(78.23,19.09) v1(78.23,18.29) v1(78.23,17.48) v1(78.23,16.68) v1(78.23,15.87) v1(78.23,15.07) v1(78.24,8.19) v1(78.24,7.43) v1(78.24,6.67) v1(78.24,5.9) v1(78.24,5.14) v1(78.24,4.38) v1(78.24,3.62) v1(78.24,2.86) v1(78.36,36.89) v1(78.36,36.13) v1(78.36,35.37) v1(78.36,34.61) v1(78.36,33.84) v1(78.36,33.08) v1(78.36,32.32) v1(78.36,31.56) v1(78.99,19.09) v1(78.99,18.29) v1(78.99,17.48) v1(78.99,16.68) v1(78.99,15.87) v1(78.99,15.07) v1(79.03,8.19) v1(79.03,7.43) v1(79.03,6.67) v1(79.03,5.9) v1(79.03,5.14) v1(79.03,4.38) v1(79.03,3.62) v1(79.03,2.86) v1(79.17,36.89) v1(79.17,36.13) v1(79.17,35.37) v1(79.17,34.61) v1(79.17,33.84) v1(79.17,33.08) v1(79.17,32.32) v1(79.17,31.56) v1(79.69,40.32) v1(79.69,39.56) v1(79.69,38.8) v1(79.69,38.04) v1(79.76,19.09) v1(79.76,18.29) v1(79.76,17.48) v1(79.76,16.68) v1(79.76,15.87) v1(79.76,15.07) v1(79.96,36.89) v1(79.96,36.13) v1(79.96,35.37) v1(79.96,34.61) v1(79.96,33.84) v1(79.96,33.08) v1(79.96,32.32) v1(79.96,31.56) v1(80.18,4.63) v1(80.18,3.87) v1(80.18,3.11) v1(80.18,2.35) v1(80.18,1.59) v1(80.5,40.32) v1(80.5,39.56) v1(80.5,38.8) v1(80.5,38.04) v1(80.52,19.09) v1(80.52,18.29) v1(80.52,17.48) v1(80.52,16.68) v1(80.52,15.87) v1(80.52,15.07) v1(80.77,36.89) v1(80.77,36.13) v1(80.77,35.37) v1(80.77,34.61) v1(80.77,33.84) v1(80.77,33.08) v1(80.77,32.32) v1(80.77,31.56) v1(80.99,4.63) v1(80.99,3.87) v1(80.99,3.11) v1(80.99,2.35) v1(80.99,1.59) v1(81.31,40.32) v1(81.31,39.56) v1(81.31,38.8) v1(81.31,38.04) v1(81.49,14.92) v1(81.49,14.16) v1(81.49,13.4) v1(81.49,12.64) v1(81.58,36.89) v1(81.58,36.13) v1(81.58,35.37) v1(81.58,34.61) v1(81.58,33.84) v1(81.58,33.08) v1(81.58,32.32) v1(81.58,31.56) v1(81.57,19.11) v1(81.57,18.35) v1(81.57,17.59) v1(81.57,16.83) v1(81.57,16.06) v1(81.78,4.63) v1(81.78,3.87) v1(81.78,3.11) v1(81.78,2.35) v1(81.78,1.59) v1(82.11,40.32) v1(82.11,39.56) v1(82.11,38.8) v1(82.11,38.04) v1(82.25,57.09) v1(82.25,56.32) v1(82.25,55.56) v1(82.25,54.8) v1(82.25,54.04) v1(82.25,53.28) v1(82.25,52.51) v1(82.25,51.75) v1(82.21,50.86) v1(82.3,14.92) v1(82.3,14.16) v1(82.3,13.4) v1(82.3,12.64) v1(82.38,36.89) v1(82.38,36.13) v1(82.38,35.37) v1(82.38,34.61) v1(82.38,33.84) v1(82.38,33.08) v1(82.38,32.32) v1(82.38,31.56) v1(82.38,19.11) v1(82.38,18.35) v1(82.38,17.59) v1(82.38,16.83) v1(82.38,16.06) v1(82.59,4.63) v1(82.59,3.87) v1(82.59,3.11) v1(82.59,2.35) v1(82.59,1.59) v1(83.06,57.09) v1(83.06,56.32) v1(83.06,55.56) v1(83.06,54.8) v1(83.06,54.04) v1(83.06,53.28) v1(83.06,52.51) v1(83.06,51.75) v1(83.14,50.86) v1(83.12,40.32) v1(83.12,39.56) v1(83.12,38.8) v1(83.12,38.04) v1(83.1,14.92) v1(83.1,14.16) v1(83.1,13.4) v1(83.1,12.64) v1(83.19,36.89) v1(83.19,36.13) v1(83.19,35.37) v1(83.19,34.61) v1(83.19,33.84) v1(83.19,33.08) v1(83.19,32.32) v1(83.19,31.56) v1(83.18,19.11) v1(83.18,18.35) v1(83.18,17.59) v1(83.18,16.83) v1(83.18,16.06) v1(83.4,4.63) v1(83.4,3.87) v1(83.4,3.11) v1(83.4,2.35) v1(83.4,1.59) v1(83.87,57.09) v1(83.87,56.32) v1(83.87,55.56) v1(83.87,54.8) v1(83.87,54.04) v1(83.87,53.28) v1(83.87,52.51) v1(83.87,51.75) v1(83.93,40.32) v1(83.93,39.56) v1(83.93,38.8) v1(83.93,38.04) v1(83.99,36.89) v1(83.99,36.13) v1(83.99,35.37) v1(83.99,34.61) v1(83.99,33.84) v1(83.99,33.08) v1(83.99,32.32) v1(83.99,31.56) v1(83.99,19.11) v1(83.99,18.35) v1(83.99,17.59) v1(83.99,16.83) v1(83.99,16.06) v1(84.11,50.86) v1(84.24,4.76) v1(84.24,4) v1(84.24,3.24) v1(84.24,2.48) v1(84.24,1.71) v1(84.66,57.09) v1(84.66,56.32) v1(84.66,55.56) v1(84.66,54.8) v1(84.66,54.04) v1(84.66,53.28) v1(84.66,52.51) v1(84.66,51.75) v1(84.74,40.32) v1(84.74,39.56) v1(84.74,38.8) v1(84.74,38.04) v1(84.8,19.11) v1(84.8,18.35) v1(84.8,17.59) v1(84.8,16.83) v1(84.8,16.06) v1(85.05,50.86) v1(85.03,36.89) v1(85.03,36.13) v1(85.03,35.37) v1(85.03,34.61) v1(85.05,33.72) v1(85.05,32.96) v1(85.05,32.19) v1(85.05,4.76) v1(85.05,4) v1(85.05,3.24) v1(85.05,2.48) v1(85.05,1.71) v1(85.47,57.09) v1(85.47,56.32) v1(85.47,55.56) v1(85.47,54.8) v1(85.47,54.04) v1(85.47,53.28) v1(85.47,52.51) v1(85.47,51.75) v1(85.53,40.32) v1(85.53,39.56) v1(85.53,38.8) v1(85.53,38.04) v1(85.83,36.89) v1(85.83,36.13) v1(85.83,35.37) v1(85.83,34.61) v1(85.81,19.11) v1(85.81,18.35) v1(85.81,17.59) v1(85.81,16.83) v1(85.85,4.76) v1(85.85,4) v1(85.85,3.24) v1(85.85,2.48) v1(85.85,1.71) v1(85.86,33.72) v1(85.86,32.96) v1(85.86,32.19) v1(86.02,50.86) v1(86.28,57.09) v1(86.28,56.32) v1(86.28,55.56) v1(86.28,54.8) v1(86.28,54.04) v1(86.28,53.28) v1(86.28,52.51) v1(86.28,51.75) v1(86.55,40.32) v1(86.55,39.56) v1(86.55,38.8) v1(86.55,38.04) v1(86.64,36.89) v1(86.64,36.13) v1(86.64,35.37) v1(86.64,34.61) v1(86.62,19.11) v1(86.62,18.35) v1(86.62,17.59) v1(86.62,16.83) v1(86.65,33.72) v1(86.65,32.96) v1(86.65,32.19) v1(86.65,4.76) v1(86.65,4) v1(86.65,3.24) v1(86.65,2.48) v1(86.65,1.71) v1(86.95,50.86) v1(87.08,57.09) v1(87.08,56.32) v1(87.08,55.56) v1(87.08,54.8) v1(87.08,54.04) v1(87.08,53.28) v1(87.08,52.51) v1(87.08,51.75) v1(87.36,40.32) v1(87.36,39.56) v1(87.36,38.8) v1(87.36,38.04) v1(87.44,36.89) v1(87.44,36.13) v1(87.44,35.37) v1(87.44,34.61) v1(87.44,27.24) v1(87.44,26.48) v1(87.44,25.72) v1(87.44,24.95) v1(87.44,24.19) v1(87.42,19.11) v1(87.42,18.35) v1(87.42,17.59) v1(87.42,16.83) v1(87.46,4.76) v1(87.46,4) v1(87.46,3.24) v1(87.46,2.48) v1(87.46,1.71) v1(87.71,12.25) v1(87.71,11.49) v1(87.71,10.73) v1(87.71,9.97) v1(87.71,9.21) v1(87.71,8.44) v1(87.71,7.68) v1(87.71,6.92) v1(87.88,57.09) v1(87.88,56.32) v1(87.88,55.56) v1(87.88,54.8) v1(87.88,54.04) v1(87.88,53.28) v1(87.88,52.51) v1(87.88,51.75) v1(87.92,50.86) v1(88.17,40.32) v1(88.17,39.56) v1(88.17,38.8) v1(88.17,38.04) v1(88.24,27.24) v1(88.24,26.48) v1(88.24,24.95) v1(88.24,24.19) v1(88.52,12.25) v1(88.52,11.49) v1(88.52,10.73) v1(88.52,9.97) v1(88.52,9.21) v1(88.52,8.44) v1(88.52,7.68) v1(88.52,6.92) v1(88.69,57.09) v1(88.69,56.32) v1(88.69,55.56) v1(88.69,54.8) v1(88.69,54.04) v1(88.69,53.28) v1(88.69,52.51) v1(88.69,51.75) v1(88.86,50.86) v1(88.96,40.32) v1(88.96,39.56) v1(88.96,38.8) v1(88.96,38.04) v1(89.04,27.24) v1(89.04,26.48) v1(89.04,25.72) v1(89.04,24.95) v1(89.04,24.19) v1(89.33,12.25) v1(89.33,11.49) v1(89.33,10.73) v1(89.33,9.97) v1(89.33,9.21) v1(89.33,8.44) v1(89.33,7.68) v1(89.33,6.92) v1(89.85,27.24) v1(89.85,26.48) v1(89.85,25.72) v1(89.85,24.95) v1(89.85,24.19) v1(90.12,12.25) v1(90.12,11.49) v1(90.12,10.73) v1(90.12,9.97) v1(90.12,9.21) v1(90.12,8.44) v1(90.12,7.68) v1(90.12,6.92) v1(90.52,35.5) v1(90.74,28.64) v1(90.74,27.88) v1(90.74,27.11) v1(90.74,26.35) v1(90.74,25.59) v1(90.93,12.25) v1(90.93,11.49) v1(90.93,10.73) v1(90.93,9.97) v1(90.93,9.21) v1(90.93,8.44) v1(90.93,7.68) v1(90.93,6.92) v1(91.54,28.64) v1(91.54,27.88) v1(91.54,27.11) v1(91.54,26.35) v1(91.54,25.59) v1(91.74,12.25) v1(91.74,11.49) v1(91.74,10.73) v1(91.74,9.97) v1(91.74,9.21) v1(91.74,8.44) v1(91.74,7.68) v1(91.74,6.92) v1(92.35,28.64) v1(92.35,27.88) v1(92.35,27.11) v1(92.35,26.35) v1(92.35,25.59) v1(92.54,12.25) v1(92.54,11.49) v1(92.54,10.73) v1(92.54,9.97) v1(92.54,9.21) v1(92.54,8.44) v1(92.54,7.68) v1(92.54,6.92) v1(93.15,28.64) v1(93.15,27.88) v1(93.15,27.11) v1(93.15,26.35) v1(93.15,25.59) v1(93.34,12.25) v1(93.34,11.49) v1(93.34,10.73) v1(93.34,9.97) v1(93.34,9.21) v1(93.34,8.44) v1(93.34,7.68) v1(93.34,6.92) v1(94.15,12.25) v1(94.15,11.49) v1(94.15,10.73) v1(94.15,9.97) v1(94.15,9.21) v1(94.15,8.44) v1(94.15,7.68) v1(94.15,6.92)
VCC3.3_DCDC: length 128.7
  Top Layer w0.254: H7.1 59.94,3.49 59.94,6.79 62.61,9.46 83.19,9.46 U7.2 ; H8.1 86.23,46.29 74.04,46.29 70.87,49.47 37.43,49.47 C18.1
  Top Layer w0.508: U6.5 34.16,48.26 C17.2 36.17,48.26 C18.1
  Bottom Layer w0.254: H8.1 89.53,43.24 94.36,38.42 94.36,20.64 U7.2
VCC3.3_MCU: length 33.2
  Top Layer w0.635: U11.1 U12.20 31.05,28.06 C9.2 31.05,33.81 C21.1 31.12,33.88 31.12,39.05 27.5,42.67 U3.5
VCC5.0_DCDC: length 70.3
  Top Layer w0.635: U6.1 30.67,48.26 31.08,47.84 31.08,46.64 30.73,46.29 29.97,46.29 31.75,44.51 v1(34.29,44.51) ; U12.18 36.12,40.39 33.15,43.37 29.84,43.37 27.18,46.04 ; 21.21,42.67 23.35,42.67 U3.1 24.2,42.67 24.51,42.35 24.51,41.08 24.2,40.77 U3.3 ; U6.3 29.83,46.35 C16.2 ; v1(46.1,41.46) 50.27,37.29 U2.4
  Top Layer w0.762: U14.5 21.65,48.77 24.13,46.29 27.12,46.29
  Bottom Layer w0.635: v1(46.1,41.46) 37.34,41.46 v1(34.29,44.51)
VCC7.4: length 67.8
  Top Layer w1.27: 62.1,47.18 45.34,47.18 v2(37.72,39.56) ; L5.2 3.65,27.08 2.41,25.84 2.41,23.5 LED.2
  Bottom Layer w1.27: U5.1 62.1,48.34 62.1,47.18 ; v2(37.72,39.56) 31.75,39.56 21.11,28.92 C20.1
AIN1: length 25
  Bottom Layer w0.254: U2.3 52.58,37.02 52.58,25.84 51.36,24.63 U11.9
AIN2: length 25
  Bottom Layer w0.254: U11.10 53.9,22.98 55.12,24.19 55.12,37.02 U2.2
AO1: length 30.1
  Top Layer w0.254: U5.4 50.27,53 52.45,55.18 75.06,55.18 U13.1
AO2: length 32
  Bottom Layer w0.254: U5.5 47.73,48.72 51.56,44.89 65.53,44.89 67.06,46.42 67.06,50.68 U13.6
BIN1: length 9.8
  Bottom Layer w0.254: U2.5 47.73,33.95 46.28,32.5 U12.14
BIN2: length 9.8
  Bottom Layer w0.254: U12.15 43.74,32.5 45.19,33.95 U2.6
BO1: length 12.8
  Top Layer w0.254: U14.1 33.94,54.67 40.53,54.67 U5.7
BO2: length 29
  Top Layer w0.254: U14.6 19.15,52.49 22.61,55.94 41.8,55.94 U5.6
E1A: length 85.6
  Top Layer w0.254: U11.11 56.44,17.26 64.39,25.21 81.41,25.21 93.85,37.65 93.85,47.43 92.71,48.58 74.16,48.58 U13.4
E1B: length 85
  Top Layer w0.254: U13.3 75.26,49.97 93.09,49.97 96.01,47.05 96.01,37.15 82.55,23.68 65.41,23.68 58.98,17.26 U11.12
E2A: length 68.1
  Top Layer w0.254: v1(68.96,50.48) v1(45.09,50.48) 26.06,50.48 U14.4
  Bottom Layer w0.254: U12.5 69.14,38.24 68.96,38.42 v1(68.96,50.48)
E2B: length 50.6
  Bottom Layer w0.254: U14.3 26.65,52.28 28.45,50.48 38.23,50.48 44.58,44.13 50.67,44.13 55.37,39.43 59.69,39.43 61.52,37.6 U12.8
MPU6050_SCL: length 15.8
  Top Layer w0.254: H7.3 62.1,10.73 64.52,10.73 U11.15
MPU6050_SDA: length 20.9
  Bottom Layer w0.254: U11.16 66.42,10.1 58.93,10.1 H7.4
OLED_SCL: length 55.5
  Top Layer w0.254: v1(58.17,20.76) 58.17,23.68 56.9,24.95 44.3,24.95 U12.16
  Bottom Layer w0.254: U7.3 v1(58.17,20.76)
OLED_SDA: length 55.3
  Top Layer w0.254: U12.17 43.41,23.3 v1(56.11,23.3)
  Bottom Layer w0.254: U7.4 v1(56.11,23.3)
PWMA: length 31.8
  Top Layer w0.254: U2.1 54.48,33.84 v1(50.04,33.84)
  Bottom Layer w0.254: v1(50.04,33.84) 50.04,27.32 46.35,23.64 U11.7
PWMB: length 25.1
  Bottom Layer w0.254: U2.7 42.42,37.02 42.42,16.57 43.74,15.25 U11.6
RXD: length 25.4
  Top Layer w0.254: H8.5 74.42,38.54 67.69,38.54 64.06,34.91 U12.7
TXD: length 24.6
  Top Layer w0.254: U12.6 66.6,33.64 69.98,37.02 75.44,37.02 H8.4
$1N297: length 2.8
  Top Layer w0.254: 18.35,37.53 18.35,36.59 U1.6
$1N352:
  vias: v1(2.67,31.18) v1(3.62,31.18) v1(4.6,31.18) v1(5.46,31.18) v1(15.11,37.91) v1(15.11,37) v1(15.37,34.73) v1(15.37,34.1) v1(15.75,37.91) v1(15.75,37.02) v1(15.68,33.46) v1(15.68,32.79) v1(15.68,32.11) v1(16,34.73) v1(16,34.1)
$1N811: length 4.6
  Top Layer w0.254: U1.5 18.8,34.35 18.29,33.84 18.29,30.8 R1.1
$1N888: length 13.1
  Top Layer w0.254: U1.4 20.39,33.4 20.7,33.72 20.7,39.31 20.19,39.81 18.3,39.81 R2.2 18.23,39.88 C7.1 16.46,39.82 R3.1
$1N8122: length 2.1
  Top Layer w0.762: LED.1 2.39,19.74 R8.1
$1N8599: length 5.8
  Top Layer w1.27: 11.49,13.96 11.49,19.68 U16.2

## Copper pours and planes (outline as drawn; the poured copper is in the pictures)
GND on Top Layer: -17.53,69.28 112.65,69.28 112.65,-22.29 -17.53,-22.29
GND on Bottom Layer: -24.64,73.6 119.25,73.6 119.25,-25.59 -24.64,-25.59
VCC5.0_DCDC on Top Layer: 1.14,37.65 6.22,37.65 6.22,38.16 13.21,38.16 13.21,40.56 17.46,40.56 17.46,42.24 24,42.23 24.01,45.53 30.61,45.53 30.61,46.93 20.2,46.93 20.2,43.88 13.21,43.88 13.21,41.69 1.17,41.69 1.14,41.72
VCC5.0_DCDC on Bottom Layer: 54.05,50.83 56.6,50.83 56.6,53.77 66.68,53.77 66.68,51.05 69.13,51.05 69.13,56.7 20.32,56.7 20.32,50.74 22.96,50.74 22.96,53.77 54.05,53.77
VCC7.4 on Top Layer: 16.38,33.72 17.53,33.72 17.53,29.81 16.38,29.81
VCC7.4 on Top Layer: 5.31,25.94 19.68,25.94 19.68,23.5 22.35,23.5 22.35,28.38 17.47,28.38 17.47,31.56 15.07,31.56 15.07,34.35 8.29,34.35 8.29,28.53 4.95,28.53 4.95,25.97 5.31,25.97
$1N352 on Top Layer: 14.86,38.54 17.65,38.54 17.65,36.51 14.86,36.51
$1N352 on Top Layer: 1.78,34.1 6.35,34.1 6.35,30.8 1.78,30.8
$1N352 on Top Layer: 14.99,34.86 17.78,34.86 17.78,33.84 14.99,33.84
$1N352 on Bottom Layer: 1.78,30.8 16.37,30.8 16.37,38.02 16.38,38.04 15.05,38.04 15.05,31.56 1.78,31.56
$1N8596 on Top Layer: 14.97,23.3 8.29,23.3 8.29,17.52 5.21,17.52 5.21,26.1 5.21,26.1 14.97,26.1

Small or netless copper shapes (teardrops, artwork), in the pictures only: 64 on Top Layer, 29 on Bottom Layer

## Text on the board
Top Silkscreen Layer: TPS563201DDCR | MCU | MPU6050 | OLED | UART | STM32F103C8T6 | TB6612 | Sakura
